# Altium project 2017_Ozone.PrjPcb
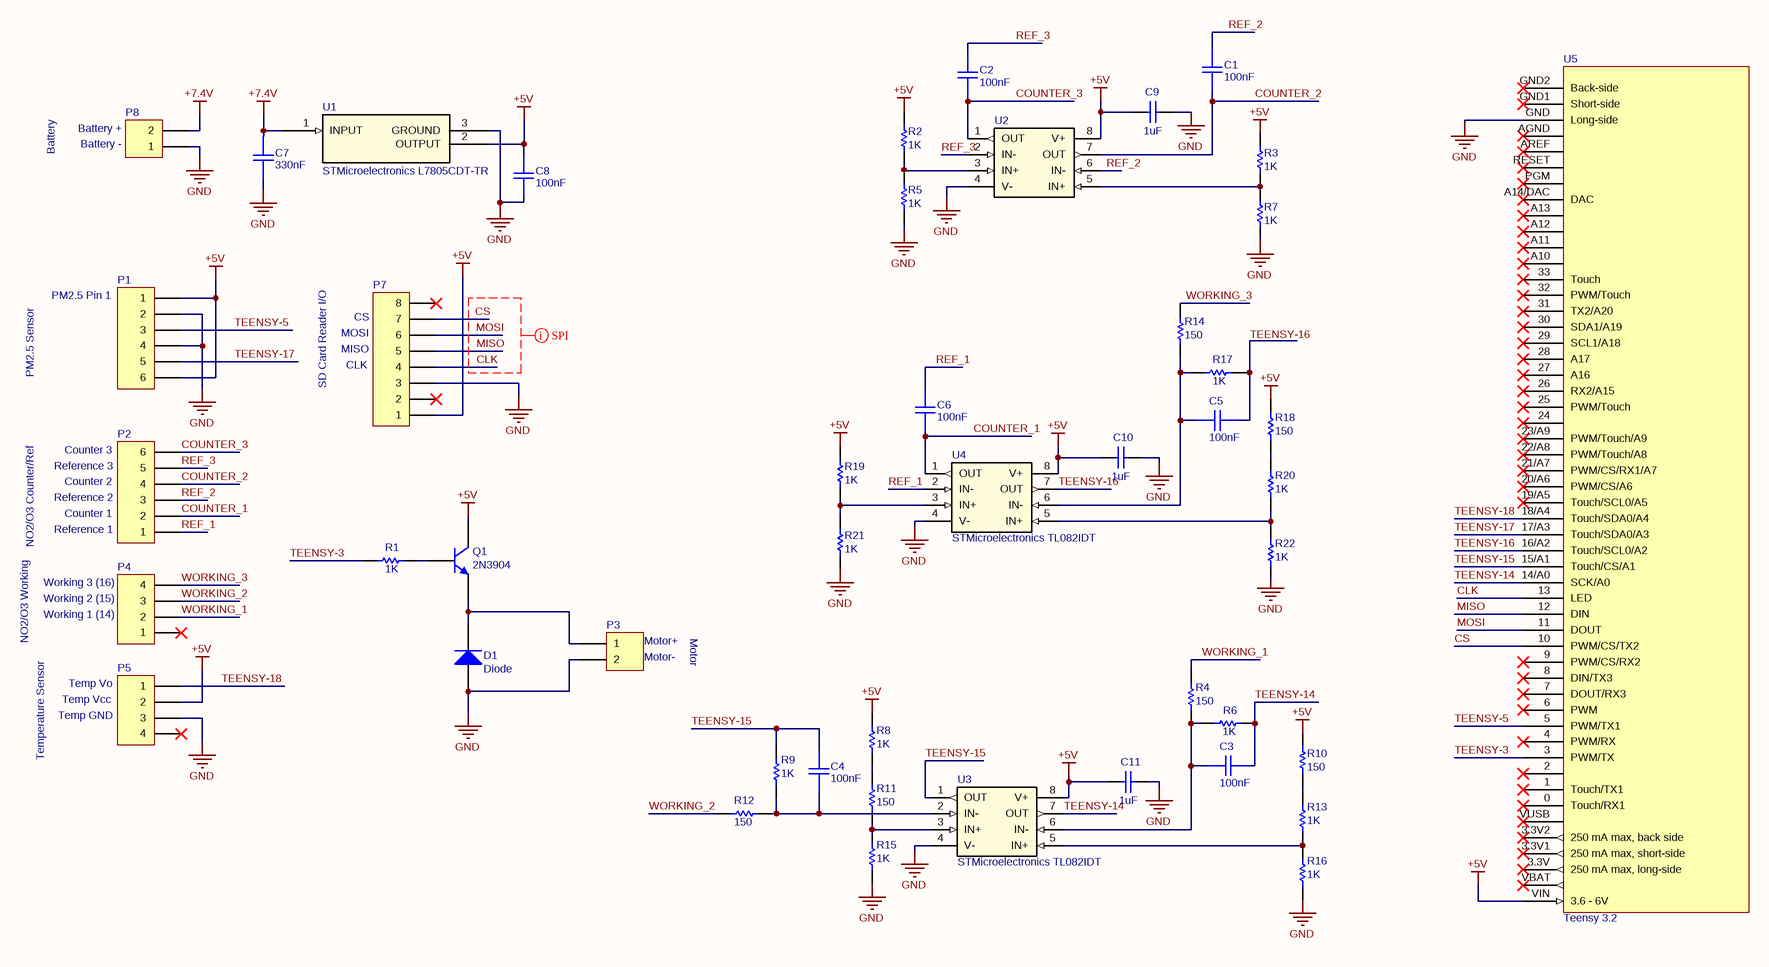
[diagram p0: 2017_Ozone.SchDoc]
1 sheet, 47 parts. Net scope: global (net labels, ports and power ports of the same name join across sheets).
Board file: 2017_Ozone.PcbDoc

## Sheet 2017_Ozone.SchDoc
size A3

### Parts
C1  100nF  [Yageo CC0603ZRY5V9BB104 (1608)]
C2  100nF  [Yageo CC0603ZRY5V9BB104 (1608)]
C3  100nF  [Yageo CC0603ZRY5V9BB104 (1608)]
C4  100nF  [Yageo CC0603ZRY5V9BB104 (1608)]
C5  100nF  [Yageo CC0603ZRY5V9BB104 (1608)]
C6  100nF  [Yageo CC0603ZRY5V9BB104 (1608)]
C7  330nF  [Yageo CC0603ZRY5V9BB104 (1608)]
C8  100nF  [Yageo CC0603ZRY5V9BB104 (1608)]
C9  value 1uF  [Yageo CC0603ZRY5V9BB104 (1608)]  (hidden comment: Cap)
C10  value 1uF  [Yageo CC0603ZRY5V9BB104 (1608)]  (hidden comment: Cap)
C11  value 1uF  [Yageo CC0603ZRY5V9BB104 (1608)]  (hidden comment: Cap)
D1  Diode  [SOT95P240X120-3N]
P1  Molex 0430450600  [Molex 0430450600]  (value not drawn)
P2  Molex 0430450600  [Molex 0430450600]  (value not drawn)
P3  Molex 0430450200  [Molex 0430450200]  (value not drawn)
P4  Molex 0430450400  [Molex 0430450400]  (value not drawn)
P5  Molex 0430450400  [Molex 0430450400]  (value not drawn)
P7  Molex 0430450800  [Molex 0430450800]  (value not drawn)
P8  Molex 0430450200  [Molex 0430450200]  (value not drawn)
Q1  2N3904  [TO92]
R1  value 1K  [Panasonic ERJ-Series (1608)]  (hidden comment: 1k Ohm)
R2  value 1K  [Panasonic ERJ-Series (1608)]  (hidden comment: 1k Ohm)
R3  value 1K  [Panasonic ERJ-Series (1608)]  (hidden comment: 1k Ohm)
R4  value 150  [Panasonic ERJ-Series (1608)]  (hidden comment: 150 Ohm)
R5  value 1K  [Panasonic ERJ-Series (1608)]  (hidden comment: 1k Ohm)
R6  value 1K  [Panasonic ERJ-Series (1608)]  (hidden comment: 1k Ohm)
R7  value 1K  [Panasonic ERJ-Series (1608)]  (hidden comment: 1k Ohm)
R8  value 1K  [Panasonic ERJ-Series (1608)]  (hidden comment: Panasonic ERJ-3GEYJ102V)
R9  value 1K  [Panasonic ERJ-Series (1608)]  (hidden comment: 1k Ohm)
R10  value 150  [Panasonic ERJ-Series (1608)]  (hidden comment: 150 Ohm)
R11  value 150  [Panasonic ERJ-Series (1608)]  (hidden comment: 150 Ohm)
R12  value 150  [Panasonic ERJ-Series (1608)]  (hidden comment: 150 Ohm)
R13  value 1K  [Panasonic ERJ-Series (1608)]  (hidden comment: 1k Ohm)
R14  value 150  [Panasonic ERJ-Series (1608)]  (hidden comment: 150 Ohm)
R15  value 1K  [Panasonic ERJ-Series (1608)]  (hidden comment: 1k Ohm)
R16  value 1K  [Panasonic ERJ-Series (1608)]  (hidden comment: 1k Ohm)
R17  value 1K  [Panasonic ERJ-Series (1608)]  (hidden comment: 1k Ohm)
R18  value 150  [Panasonic ERJ-Series (1608)]  (hidden comment: 150 Ohm)
R19  value 1K  [Panasonic ERJ-Series (1608)]  (hidden comment: 1k Ohm)
R20  value 1K  [Panasonic ERJ-Series (1608)]  (hidden comment: Panasonic ERJ-3GEYJ102V)
R21  value 1K  [Panasonic ERJ-Series (1608)]  (hidden comment: 1k Ohm)
R22  value 1K  [Panasonic ERJ-Series (1608)]  (hidden comment: 1k Ohm)
U1  STMicroelectronics L7805CDT-TR  [STMicroelectronics L7805CDT-TR]
U2  STMicroelectronics TL082IDT  [STMicroelectronics TL082IDT (8-SOIC)]  (value not drawn)
U3  STMicroelectronics TL082IDT  [STMicroelectronics TL082IDT (8-SOIC)]
U4  STMicroelectronics TL082IDT  [STMicroelectronics TL082IDT (8-SOIC)]
U5  Teensy 3.2  [PJRC TEENSY 3.2]

### Nets
+5V: C8.2 C9.1 C10.1 C11.1 P1.1 P1.6 P5.2 P7.1 Q1.3(C) R2.1 R3.1 R8.1 R10.1 R18.2 R19.1 U1.2(OUTPUT) U2.8(V+) U3.8(V+) U4.8(V+) U5.VIN(3.6_-_6V)
+7.4V: C7.2 P8.2 U1.1(INPUT)
GND: C7.1 C8.1 C9.2 C10.2 C11.2 D1.1(A) P1.2 P1.4 P3.2 P5.3 P7.3 P8.1 R5.2 R7.2 R15.1 R16.1 R21.2 R22.2 U1.3(GROUND) U2.4(V-) U3.4(V-) U4.4(V-) U5.GND(Long-side)
CLK: P7.4 U5.13(LED)
COUNTER_1: C6.1 P2.2 U4.1(OUT)
COUNTER_2: C1.1 P2.4 U2.7(OUT)
COUNTER_3: C2.1 P2.6 U2.1(OUT)
CS: P7.7 U5.10(PWM/CS/TX2)
MISO: P7.5 U5.12(DIN)
MOSI: P7.6 U5.11(DOUT)
REF_1: C6.2 P2.1 U4.2(IN-)
REF_2: C1.2 P2.3 U2.6(IN-)
REF_3: C2.2 P2.5 U2.2(IN-)
TEENSY-3: R1.1 U5.3(PWM/TX)
TEENSY-5: P1.3 U5.5(PWM/TX1)
TEENSY-14: C3.2 R6.2 U3.7(OUT) U5.14/A0(SCK/A0)
TEENSY-15: C4.2 R9.2 U3.1(OUT) U5.15/A1(Touch/CS/A1)
TEENSY-16: C5.2 R17.2 U4.7(OUT) U5.16/A2(Touch/SCL0/A2)
TEENSY-17: P1.5 U5.17/A3(Touch/SDA0/A3)
TEENSY-18: P5.1 U5.18/A4(Touch/SDA0/A4)
WORKING_1: P4.2 R4.2
WORKING_2: P4.3 R12.2
WORKING_3: P4.4 R14.2
NetC3_1: C3.1 R4.1 R6.1 U3.6(IN-)
NetC4_1: C4.1 R9.1 R12.1 U3.2(IN-)
NetC5_1: C5.1 R14.1 R17.1 U4.6(IN-)
NetD1_2: D1.2(K) P3.1 Q1.1(E)
NetQ1_2: Q1.2(B) R1.2
NetR2_2: R2.2 R5.1 U2.3(IN+)
NetR3_2: R3.2 R7.1 U2.5(IN+)
NetR8_2: R8.2 R11.2
NetR10_2: R10.2 R13.2
NetR11_1: R11.1 R15.2 U3.3(IN+)
NetR13_1: R13.1 R16.2 U3.5(IN+)
NetR18_1: R18.1 R20.1
NetR19_2: R19.2 R21.1 U4.3(IN+)
NetR20_2: R20.2 R22.1 U4.5(IN+)

Not connected (* = marked no-connect by the designer): P4 1*; P5 4*; P7 2* 8*; U5 0(Touch/RX1)* 1(Touch/TX1)* 2* 3.3V(250_mA_max,_long-side)* 3.3V1(250_mA_max,_short-side)* 3.3V2(250_mA_max,_back_side)* 4(PWM/RX)* 6(PWM)* 7(DOUT/RX3)* 8(DIN/TX3)* 9(PWM/CS/RX2)* 19/A5(Touch/SCL0/A5)* 20/A6(PWM/CS/A6)* 21/A7(PWM/CS/RX1/A7)* 22/A8(PWM/Touch/A8)* 23/A9(PWM/Touch/A9)* 24* 25(PWM/Touch)* 26(RX2/A15)* 27(A16)* 28(A17)* 29(SCL1/A18)* 30(SDA1/A19)* 31(TX2/A20)* 32(PWM/Touch)* 33(Touch)* A10* A11* A12* A13* A14/DAC(DAC)* AGND* AREF* GND1(Short-side)* GND2(Back-side)* PGM* RESET* VBAT* VUSB*

### Layout directives
net class SPI: CLK, CS, MISO, MOSI

### Notes on the sheet
- Battery
- (near P8) Battery +
- (near P8) Battery -
- (near P1) PM2.5 Pin 1
- PM2.5 Sensor
- SD Card Reader I/O
- (near P7) MOSI
- (near P7) MISO
- (near P7) CLK
- (near P7) CS
- (near P2) Reference 2
- (near P2) Reference 3
- (near P2) Counter 3
- (near P2) Counter 2
- (near P2) Counter 1
- NO2/O3 Counter/Ref
- (near P4) Working 3 (16)
- Reference 1
- NO2/O3 Working
- (near P4) Working 2 (15)
- (near P4) Working 1 (14)
- (near P3) Motor+
- Motor
- (near P5) Temp GND
- (near P5) Temp Vcc
- Temp Vo
- (near P3) Motor-
- Temperature Sensor

### Library data of the parts
C1-C6 C8 = Yageo CC0603ZRY5V9BB104: 100 nF Capacitor; Manufacturer_Part_Number: CC0603ZRY5V9BB104; Value: 100nF; Supplier 1: Digi-Key; Supplier Part Number 1: 311-1343-1-ND
C7 = Yageo CC0603ZRY5V9BB104: 330nF Capacitor; Value: 330nF; Supplier 1: Digi-Key; Supplier Part Number 1: 311-2081-1-ND
C9-C11 = Cap: Capacitor; Published: 8-Jun-2000; LatestRevisionDate: 17-Jul-2002; LatestRevisionNote: Re-released for DXP Platform.; PackageReference: RAD-0.3; Publisher: Altium Limited; PackageDescription: Radial Cap, Thru-Hole; 2 Leads; 0.3 in Pin Spacing; Supplier 1: Digi-Key; Supplier Part Number 1: 311-1829-1-ND
D1 = Diode: Default Diode; Published: 8-Jun-2000; LatestRevisionDate: 17-Jul-2002; LatestRevisionNote: Re-released for DXP Platform.; PackageVersion: Sep-1996; PackageReference: SMC; Publisher: Altium Limited; PackageDescription: DO-214-AB/SMC; 2 C-Bend Leads; Body 7.9 x 5.9 mm, inc. leads (LxW); Code_JEDEC: DO-214-AB; Supplier 1: Digi-Key; Supplier Part Number 1: MMBD914TPMSCT-ND
Q1 = 2N3904: NPN General Purpose Amplifier; Published: 8-Jun-2000; LatestRevisionDate: 15-Jan-2003; LatestRevisionNote: PCB Footprint 'BCY-W3/D4.7' replaced; DatasheetVersion: 1997; PackageVersion: Sep-1998; PackageReference: TO-92A; Publisher: Altium Limited; PackageDescription: TO, Flat Index; 3 In-Line, Axial Leads; Body Dia. 4.5mm; Leads 0.51 x 0.48 mm (max); ComponentLink1Description: Manufacturer Link; ComponentLink1URL: http://www.fairchildsemi.com/; ComponentLink2Description: Datasheet; ComponentLink2URL: http://www.fairchildsemi.com/ds/2N%2F2N3904.pdf; Supplier 1: Digi-Key; Supplier Part Number 1: 2N3904-APCT-ND
R1 = Panasonic ERJ-3GEYJ102V: Resistor; Published: 8-Jun-2000; LatestRevisionDate: 17-Jul-2002; LatestRevisionNote: Re-released for DXP Platform.; PackageReference: AXIAL-0.3; Publisher: Altium Limited; PackageDescription: Axial Device, Thru-Hole; 2 Leads; 0.3 in Pin Spacing; Supplier 1: Digi-Key; Supplier Part Number 1: P1.0KBYCT-ND
R2 R3 R5-R7 R9 R13 R15-R17 R19 R21 R22 = 1k Ohm: Resistor; Published: 8-Jun-2000; LatestRevisionDate: 17-Jul-2002; LatestRevisionNote: Re-released for DXP Platform.; PackageReference: AXIAL-0.3; Publisher: Altium Limited; PackageDescription: Axial Device, Thru-Hole; 2 Leads; 0.3 in Pin Spacing; Supplier 1: Digi-Key; Supplier Part Number 1: P1.0KBYCT-ND
R4 R10 R12 R14 R18 = 150 Ohm: Resistor; Published: 8-Jun-2000; LatestRevisionDate: 17-Jul-2002; LatestRevisionNote: Re-released for DXP Platform.; PackageReference: AXIAL-0.3; Publisher: Altium Limited; PackageDescription: Axial Device, Thru-Hole; 2 Leads; 0.3 in Pin Spacing; Supplier 1: Digi-Key; Supplier Part Number 1: P150BYCT-ND
R8 R20 = Panasonic ERJ-3GEYJ102V: 1k Ohm Resistor; Published: 8-Jun-2000; LatestRevisionDate: 17-Jul-2002; LatestRevisionNote: Re-released for DXP Platform.; PackageReference: AXIAL-0.3; Publisher: Altium Limited; PackageDescription: Axial Device, Thru-Hole; 2 Leads; 0.3 in Pin Spacing; Supplier 1: Digi-Key; Supplier Part Number 1: P1.0KBYCT-ND
R11 = Panasonic ERJ-3GEYJ151V: 150 Ohm Resistor; Published: 8-Jun-2000; LatestRevisionDate: 17-Jul-2002; LatestRevisionNote: Re-released for DXP Platform.; PackageReference: AXIAL-0.3; Publisher: Altium Limited; PackageDescription: Axial Device, Thru-Hole; 2 Leads; 0.3 in Pin Spacing; Supplier 1: Digi-Key; Supplier Part Number 1: P150BYCT-ND
U1 = STMicroelectronics L7805CDT-TR: Linear Voltage Regulator IC Positive Fixed Output 5V 1.5A D-Pak; Supplier 1: Digi-Key; Supplier Part Number 1: 497-7255-1-ND
U2-U4 = STMicroelectronics TL082IDT: IC OPAMP JFET 4MHZ 8SO; Supplier 1: Digi-Key; Supplier Part Number 1: 497-2214-1-ND
U5 = PJRC Teensy 3.2: Teensy 3.2 Development Board
P1 P2 = Molex 0430450600: Supplier 1: Digi-Key; Supplier Part Number 1: WM1815-ND
P3 P8 = Molex 0430450200: Supplier 1: Digi-Key; Supplier Part Number 1: WM1813-ND
P4 P5 = Molex 0430450400: Supplier 1: Digi-Key; Supplier Part Number 1: WM1814-ND
P7 = Molex 0430450800: Supplier 1: Digi-Key; Supplier Part Number 1: WM1816-ND